# EAGLE schematic LARIX_V5.1 (EAGLE 6.5.0)

## Sheet 1 of 3
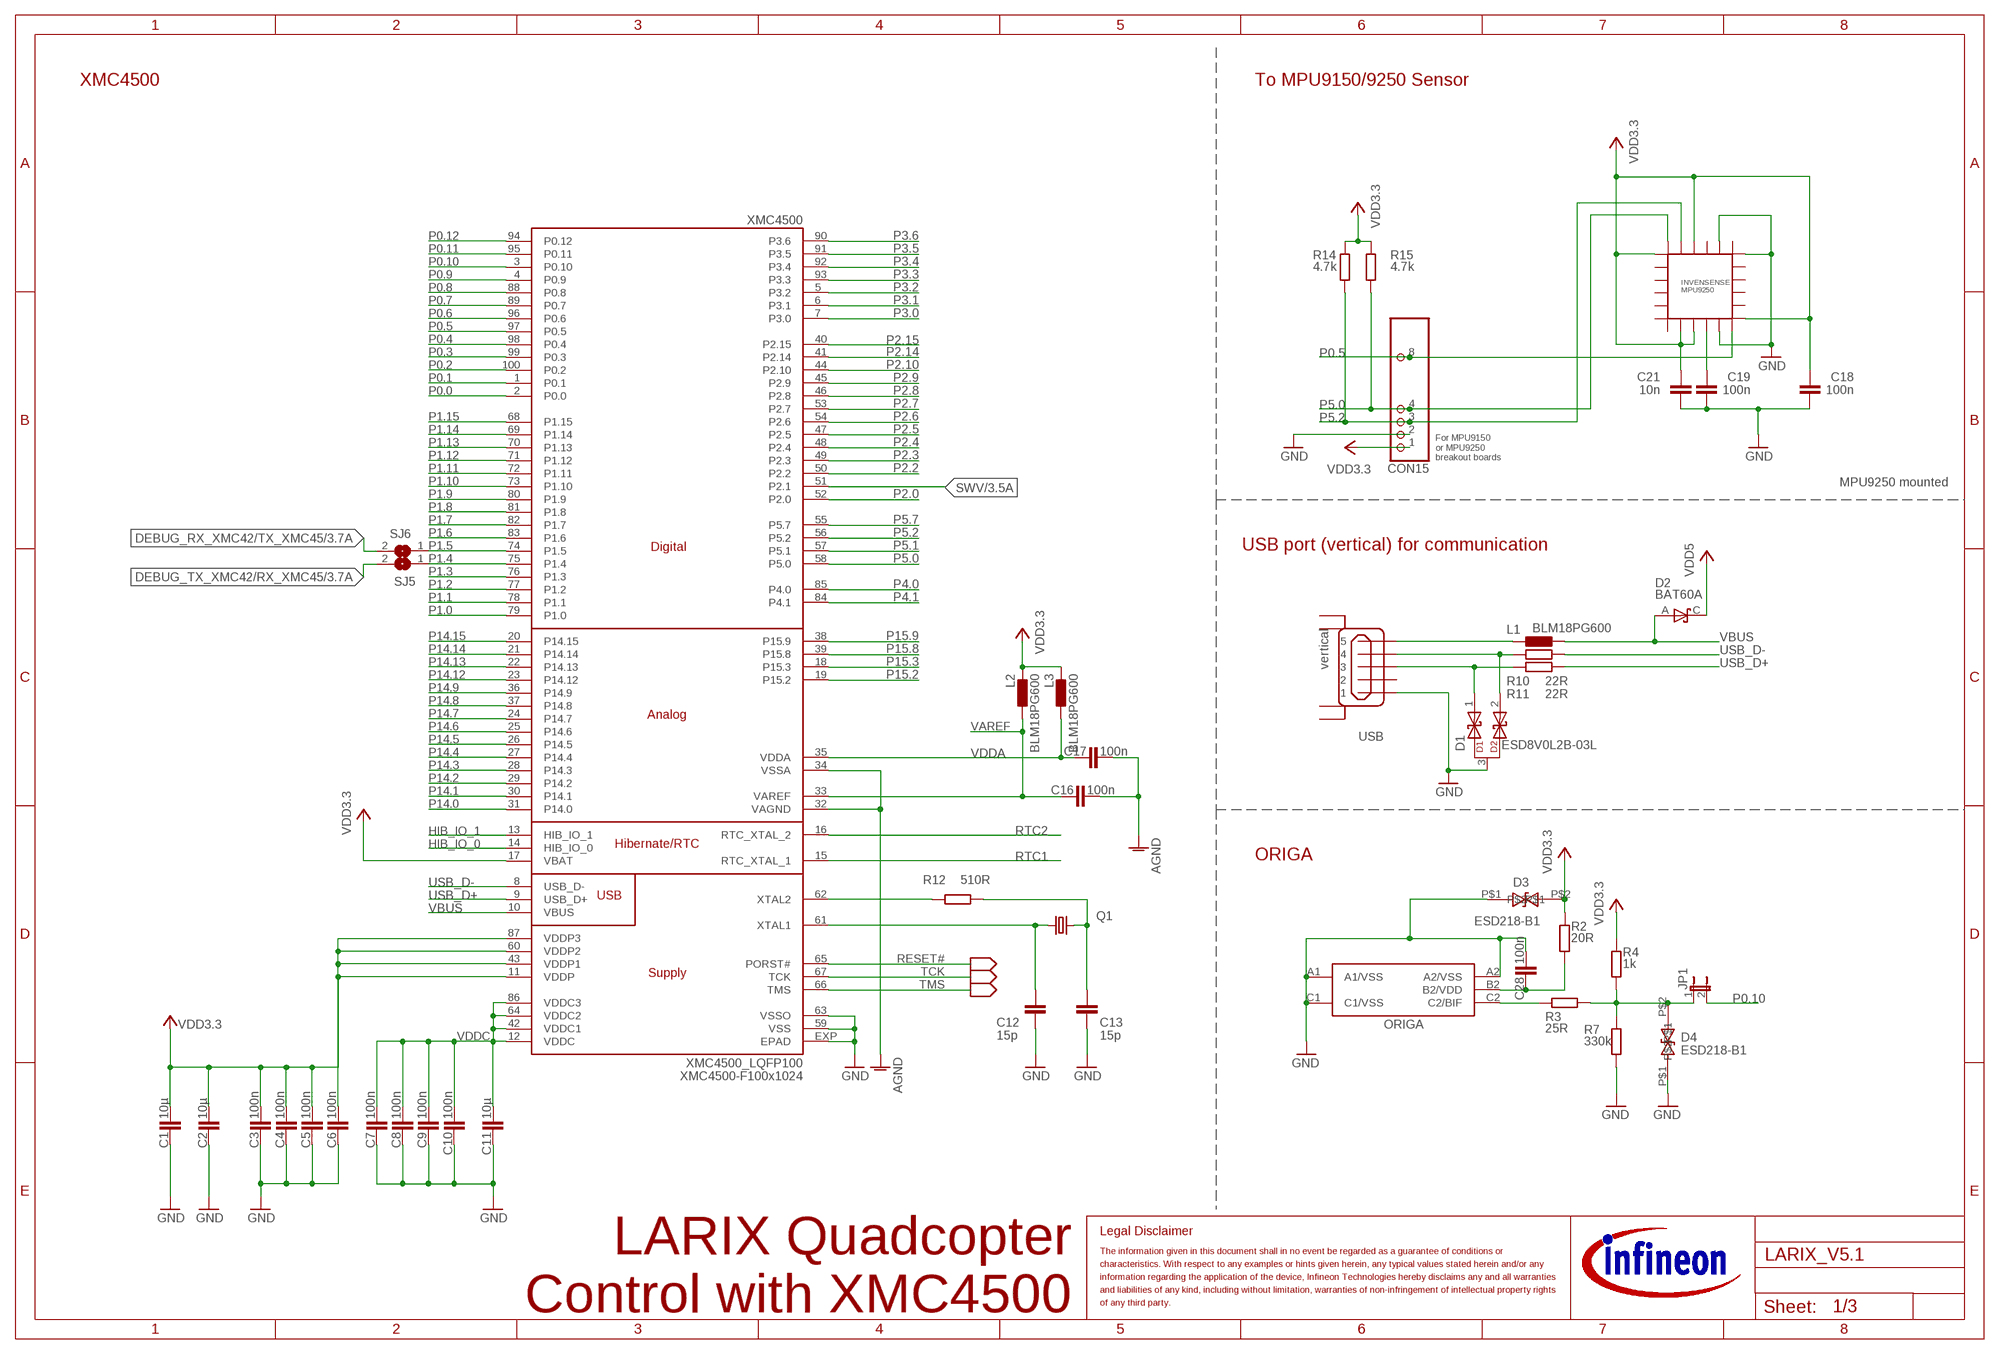
[diagram p0: schematic, sheet 1]

### Parts
C1  10µ  C-EUC0805K  [C0805K]
C2  10µ  C-EUC0805K  [C0805K]
C3  100n  C-EUC0603  [C0603]
C4  100n  C-EUC0603  [C0603]
C5  100n  C-EUC0603  [C0603]
C6  100n  C-EUC0603  [C0603]
C7  100n  C-EUC0603  [C0603]
C8  100n  C-EUC0603  [C0603]
C9  100n  C-EUC0603  [C0603]
C10  100n  C-EUC0603  [C0603]
C11  10µ  C-EUC0805K  [C0805K]
C12  15p  C-EUC0603  [C0603]
C13  15p  C-EUC0603  [C0603]
C16  100n  C-EUC0603  [C0603]
C17  100n  C-EUC0603  [C0603]
C18  100n  C-EUC0603  [C0603]
C19  100n  C-EUC0603  [C0603]
C21  10n  C-EUC0603  [C0603]
C28  100n  C-EUC0603  [C0603]
CON15  PINHD-1X10  [1X10]
D1  ESD8V0L2B-03L  [TSLP-3-1]
D2  BAT60A  BAT60  [SOD323-R]
D3  ESD218-B1-02EL  [TSLP-2-20]
D4  ESD218-B1-02EL  [TSLP-2-20]
JP1  JP1E  [JP1]
L1  BLM18PG600  L_EU_L0603  [L1608]
L2  BLM18PG600  L_EU_L0603  [L1608]
L3  BLM18PG600  L_EU_L0603  [L1608]
MPU9250  MPU9250  INVENSENSE9250EHERBY  [QFN3X3-24+]
ORIGA  ORIGA2L  [WLB-5]
Q1  12MHZ/S/3.2X2.5  NX3225_2  [32X25_4PAD]
R2  20R  R-EU_R0603  [R0603]
R3  25R  R-EU_R0603  [R0603]
R4  1k  R-EU_R0603  [R0603]
R7  330k  R-EU_R0603  [R0603]
R10  22R  R-EU_R0603  [R0603]
R11  22R  R-EU_R0603  [R0603]
R12  510R  R-EU_R0603  [R0603]
R14  4.7k  R-EU_R0603  [R0603]
R15  4.7k  R-EU_R0603  [R0603]
SJ5  SJ  [SJ]
SJ6  SJ  [SJ]
USB  vertical  MICRO_USB_VERTICAL  [USBVERTICAL]
XMC4500  XMC4500_LQFP100  XMC4400_LQFP100  [P/PG-LQFP-100-11]

### Nets
AGND: C16.2 C17.2 XMC4500.32(VAGND) XMC4500.34(VSSA)
DEBUG_RX_XMC42/TX_XMC45: SJ6.2 ; also sheet 3
DEBUG_TX_XMC42/RX_XMC45: SJ5.2 ; also sheet 3
GND: C1.2 C2.2 C3.2 C4.2 C5.2 C6.2 C7.2 C8.2 C9.2 C10.2 C11.2 C12.2 C13.2 C18.1 C19.1 C21.1 C28.1 CON15.2 D1.3 D3.P$1 D4.P$1 MPU9250.11 MPU9250.18 MPU9250.20 ORIGA.A1(A1/VSS) ORIGA.A2(A2/VSS) ORIGA.C1(C1/VSS) R7.2 USB.1 XMC4500.59(VSS) XMC4500.63(VSSO) XMC4500.EXP(EPAD) ; also sheet 2,3
HIB_IO_0: XMC4500.14(HIB_IO_0)
HIB_IO_1: XMC4500.13(HIB_IO_1)
N$2: C28.2 ORIGA.B2(B2/VDD) R2.2
N$6: R12.1 XMC4500.62(XTAL2)
N$7: C13.1 Q1.3 R12.2
N$8: C12.1 Q1.1 XMC4500.61(XTAL1)
N$9: D4.P$2 JP1.1 R3.2 R4.2 R7.1
N$11: L1.2 USB.5
N$12: ORIGA.C2(C2/BIF) R3.1
N$13: D1.2 R10.1 USB.4
N$20: C19.2 MPU9250.10
N$36: D1.1 R11.1 USB.3+
P0.0: XMC4500.2(P0.0) ; also sheet 2
P0.1: XMC4500.1(P0.1) ; also sheet 2
P0.2: XMC4500.100(P0.2) ; also sheet 2
P0.3: XMC4500.99(P0.3) ; also sheet 2
P0.4: XMC4500.98(P0.4) ; also sheet 2
P0.5: CON15.8 MPU9250.12 XMC4500.97(P0.5)
P0.6: XMC4500.96(P0.6)
P0.7: XMC4500.89(P0.7) ; also sheet 3
P0.8: XMC4500.88(P0.8)
P0.9: XMC4500.4(P0.9) ; also sheet 3
P0.10: JP1.2 XMC4500.3(P0.10)
P0.11: XMC4500.95(P0.11)
P0.12: XMC4500.94(P0.12)
P1.0: XMC4500.79(P1.0) ; also sheet 3
P1.1: XMC4500.78(P1.1) ; also sheet 3
P1.2: XMC4500.77(P1.2) ; also sheet 3
P1.3: XMC4500.76(P1.3) ; also sheet 3
P1.4: SJ5.1 XMC4500.75(P1.4)
P1.5: SJ6.1 XMC4500.74(P1.5) ; also sheet 2
P1.6: XMC4500.83(P1.6)
P1.7: XMC4500.82(P1.7)
P1.8: XMC4500.81(P1.8)
P1.9: XMC4500.80(P1.9)
P1.10: XMC4500.73(P1.10)
P1.11: XMC4500.72(P1.11)
P1.12: XMC4500.71(P1.12)
P1.13: XMC4500.70(P1.13)
P1.14: XMC4500.69(P1.14)
P1.15: XMC4500.68(P1.15) ; also sheet 2
P2.0: XMC4500.52(P2.0)
P2.2: XMC4500.50(P2.2) ; also sheet 2
P2.3: XMC4500.49(P2.3) ; also sheet 2
P2.4: XMC4500.48(P2.4) ; also sheet 2
P2.5: XMC4500.47(P2.5) ; also sheet 2
P2.6: XMC4500.54(P2.6)
P2.7: XMC4500.53(P2.7)
P2.8: XMC4500.46(P2.8)
P2.9: XMC4500.45(P2.9)
P2.10: XMC4500.44(P2.10)
P2.14: XMC4500.41(P2.14)
P2.15: XMC4500.40(P2.15)
P3.0: XMC4500.7(P3.0) ; also sheet 3
P3.1: XMC4500.6(P3.1) ; also sheet 3
P3.2: XMC4500.5(P3.2) ; also sheet 3
P3.3: XMC4500.93(P3.3)
P3.4: XMC4500.92(P3.4)
P3.5: XMC4500.91(P3.5) ; also sheet 2
P3.6: XMC4500.90(P3.6)
P4.0: XMC4500.85(P4.0) ; also sheet 2
P4.1: XMC4500.84(P4.1)
P5.0: CON15.4 MPU9250.24 R15.1 XMC4500.58(P5.0)
P5.1: XMC4500.57(P5.1) ; also sheet 2
P5.2: CON15.3 MPU9250.23 R14.1 XMC4500.56(P5.2)
P5.7: XMC4500.55(P5.7)
P14.0: XMC4500.31(P14.0)
P14.1: XMC4500.30(P14.1)
P14.2: XMC4500.29(P14.2)
P14.3: XMC4500.28(P14.3)
P14.4: XMC4500.27(P14.4)
P14.5: XMC4500.26(P14.5) ; also sheet 2
P14.6: XMC4500.25(P14.6)
P14.7: XMC4500.24(P14.7) ; also sheet 2
P14.8: XMC4500.37(P14.8) ; also sheet 2
P14.9: XMC4500.36(P14.9)
P14.12: XMC4500.23(P14.12)
P14.13: XMC4500.22(P14.13)
P14.14: XMC4500.21(P14.14)
P14.15: XMC4500.20(P14.15)
P15.2: XMC4500.19(P15.2)
P15.3: XMC4500.18(P15.3)
P15.8: XMC4500.39(P15.8)
P15.9: XMC4500.38(P15.9)
RESET#: XMC4500.65(PORST#) ; also sheet 3
RTC1: XMC4500.15(RTC_XTAL_1)
RTC2: XMC4500.16(RTC_XTAL_2)
SWV: XMC4500.51(P2.1) ; also sheet 3
TCK: XMC4500.67(TCK) ; also sheet 3
TMS: XMC4500.66(TMS) ; also sheet 3
USB_D+: R11.2 XMC4500.9(USB_D+)
USB_D-: R10.2 XMC4500.8(USB_D-)
VAREF: C16.1 L2.1 XMC4500.33(VAREF)
VBUS: D2.A L1.1 XMC4500.10(VBUS)
VDD3.3: C1.1 C2.1 C3.1 C4.1 C5.1 C6.1 C18.2 C21.2 CON15.1 D3.P$2 L2.2 L3.2 MPU9250.1 MPU9250.8 MPU9250.9 MPU9250.13 MPU9250.22 R2.1 R4.1 R14.2 R15.2 XMC4500.11(VDDP) XMC4500.17(VBAT) XMC4500.43(VDDP1) XMC4500.60(VDDP2) XMC4500.87(VDDP3) ; also sheet 2,3
VDD5: D2.C ; also sheet 2,3
VDDA: C17.1 L3.1 XMC4500.35(VDDA)
VDDC: C7.1 C8.1 C9.1 C10.1 C11.1 XMC4500.12(VDDC) XMC4500.42(VDDC1) XMC4500.64(VDDC2) XMC4500.86(VDDC3)
Unconnected: MPU9250.2 MPU9250.3 MPU9250.4 MPU9250.5 MPU9250.6 MPU9250.7 MPU9250.14 MPU9250.15 MPU9250.16 MPU9250.17 MPU9250.19 MPU9250.21 USB.2 USB.P$1(PGH1) USB.P$2(PGH2) USB.P$3(PGH3) USB.P$4(PGH4)

### Notes on the sheet
- XMC4500 | To MPU9150/9250 Sensor
- For MPU9150
  or MPU9250 
  breakout boards
- MPU9250 mounted
- USB port (vertical) for communication
- ORIGA
- D3
- ESD218-B1
- ORIGA
- D4
- ESD218-B1
- XMC4500-F100x1024
- LARIX Quadcopter 
  Control with XMC4500

## Sheet 2 of 3
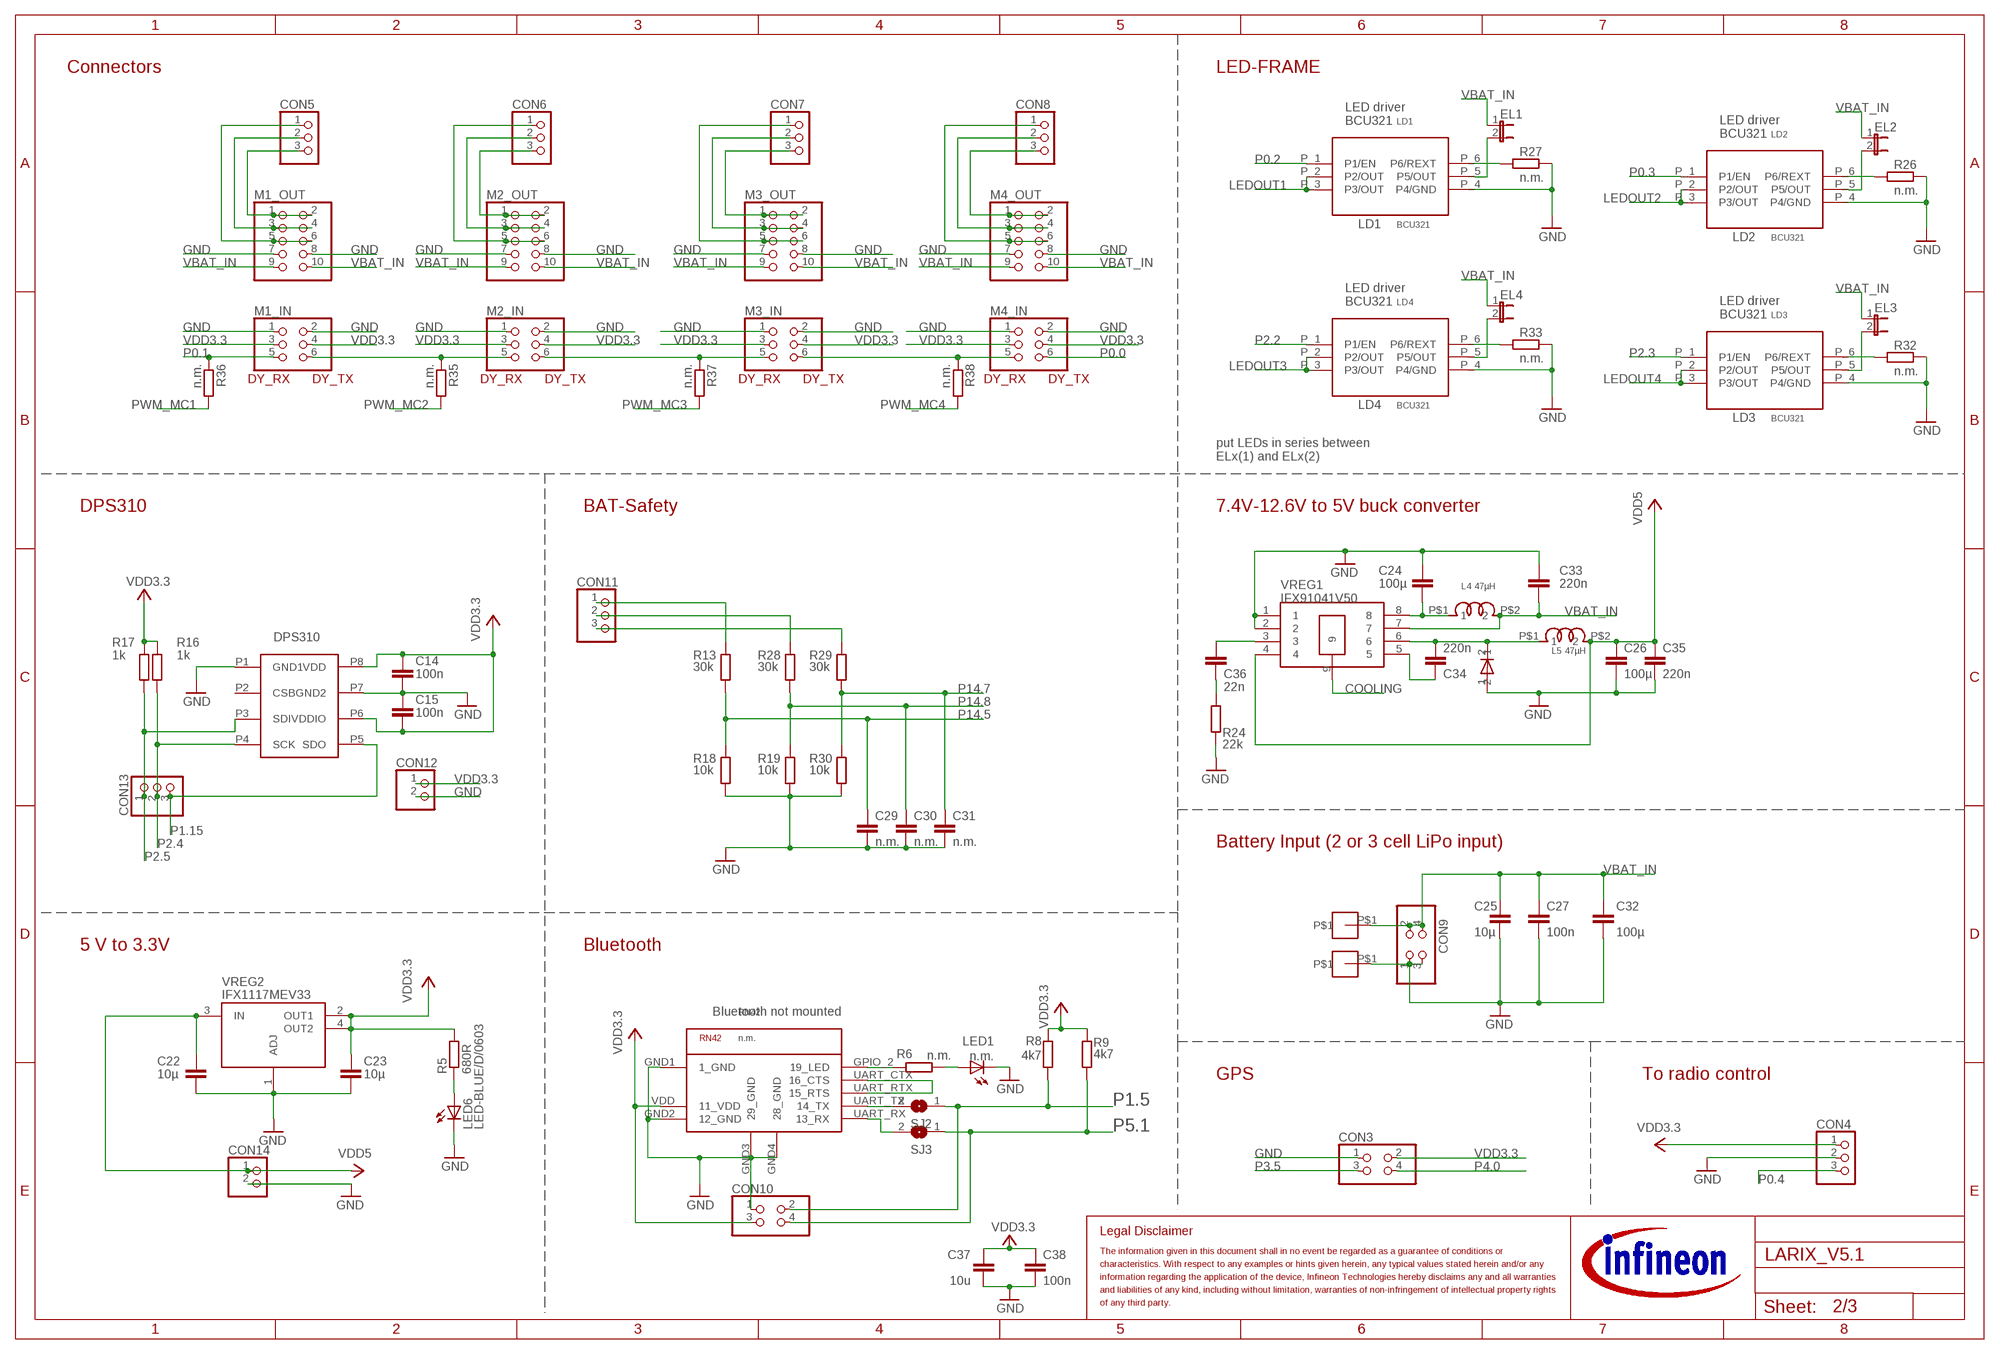
[diagram p1: schematic, sheet 2]

### Parts
C14  100n  C-EUC0603  [C0603]
C15  100n  C-EUC0603  [C0603]
C22  10µ  C-EUC0805K  [C0805K]
C23  10µ  C-EUC0805K  [C0805K]
C24  100µ  C-EUC1210  [C1210]
C25  10µ  C-EUC0805K  [C0805K]
C26  100µ  C-EUC1210  [C1210]
C27  100n  C-EUC0603  [C0603]
C29  n.m.  C-EUC0603  [C0603]
C30  n.m.  C-EUC0603  [C0603]
C31  n.m.  C-EUC0603  [C0603]
C32  100µ  C-EUC1210  [C1210]
C33  220n  C-EUC0603  [C0603]
C34  220n  C-EUC0603  [C0603]
C35  220n  C-EUC0603  [C0603]
C36  22n  C-EUC0603  [C0603]
C37  10u  C-EUC0805K  [C0805K]
C38  100n  C-EUC0603  [C0603]
CON3  PINHD-2X2  [2X02]
CON4  PINHD-1X3  [1X03]
CON5  PINHD-1X3  [1X03]
CON6  PINHD-1X3  [1X03]
CON7  PINHD-1X3  [1X03]
CON8  PINHD-1X3  [1X03]
CON9  PINHD-2X2  [2X02]
CON10  PINHD-2X2  [2X02]
CON11  PINHD-1X3  [1X03]
CON12  PINHD-1X2  [1X02]
CON13  PINHD-1X3  [1X03]
CON14  PINHD-1X2  [1X02]
D6  BAS21-03W  INF-SOD323_V_1  [INF-SOD323_V_1PRIMARY]
DPS310  Infineon  DPS310DRUCKSENSOR  [LGA8R125P0X4_500X300X120]
EL1  JP1E  [JP1]
EL2  JP1E  [JP1]
EL3  JP1E  [JP1]
EL4  JP1E  [JP1]
L4  47µH  WUERTH47UHIND  [WE-TPC]
L5  47µH  WUERTH47UHIND  [WE-TPC]
LD1  BCU321  BCU320  [SC74]
LD2  BCU321  BCU320  [SC74]
LD3  BCU321  BCU320  [SC74]
LD4  BCU321  BCU320  [SC74]
LED1  n.m.  LEDCHIPLED_0603  [CHIPLED_0603]
LED6  LED-BLUE/D/0603  LEDCHIPLED_0603  [CHIPLED_0603]
M1_IN  PINHD-2X3  [2X03]
M1_OUT  PINHD-2X5  [2X05]
M2_IN  PINHD-2X3  [2X03]
M2_OUT  PINHD-2X5  [2X05]
M3_IN  PINHD-2X3  [2X03]
M3_OUT  PINHD-2X5  [2X05]
M4_IN  PINHD-2X3  [2X03]
M4_OUT  PINHD-2X5  [2X05]
PAD1  PAD-BATTERY  [BATT-SOLDER]
PAD2  PAD-BATTERY  [BATT-SOLDER]
R5  680R  R-EU_R0603  [R0603]
R6  n.m.  R-EU_R0603  [R0603]
R8  4k7  R-EU_R0603  [R0603]
R9  4k7  R-EU_R0603  [R0603]
R13  30k  R-EU_R0603  [R0603]
R16  1k  R-EU_R0603  [R0603]
R17  1k  R-EU_R0603  [R0603]
R18  10k  R-EU_R0603  [R0603]
R19  10k  R-EU_R0603  [R0603]
R24  22k  R-EU_R0603  [R0603]
R26  n.m.  R-EU_R0603  [R0603]
R27  n.m.  R-EU_R0603  [R0603]
R28  30k  R-EU_R0603  [R0603]
R29  30k  R-EU_R0603  [R0603]
R30  10k  R-EU_R0603  [R0603]
R32  n.m.  R-EU_R0603  [R0603]
R33  n.m.  R-EU_R0603  [R0603]
R35  n.m.  R-EU_R0603  [R0603]
R36  n.m.  R-EU_R0603  [R0603]
R37  n.m.  R-EU_R0603  [R0603]
R38  n.m.  R-EU_R0603  [R0603]
RN42  n.m.  BLUETOOTHRN42+SHIELD  [RN42+SHIELD]
SJ2  SJ  [SJ]
SJ3  SJ  [SJ]
VREG1  IFX91041V50  INF-PG-DSO-8-27_N_1  [INF-PG-DSO-8-27_N_1PRIMARY]
VREG2  IFX1117MEV33  IFX1117  [SOT223]

### Nets
COOLING: VREG1.9
GND: C14.2 C15.1 C22.2 C23.2 C24.1 C25.2 C26.2 C27.2 C29.2 C30.2 C31.2 C32.2 C33.1 C35.2 C37.2 C38.2 CON3.1 CON4.2 CON9.1 CON9.3 CON10.1 CON12.2 CON14.2 D6.1 DPS310.P1(GND1) DPS310.P7(GND2) LD1.P_4(P4/GND) LD2.P_4(P4/GND) LD3.P_4(P4/GND) LD4.P_4(P4/GND) LED1.C LED6.C M1_IN.1 M1_IN.2 M1_OUT.7 M1_OUT.8 M2_IN.1 M2_IN.2 M2_OUT.7 M2_OUT.8 M3_IN.1 M3_IN.2 M3_OUT.7 M3_OUT.8 M4_IN.1 M4_IN.2 M4_OUT.7 M4_OUT.8 PAD2.P$1 R18.2 R19.2 R24.2 R26.2 R27.2 R30.2 R32.2 R33.2 RN42.GND1(1_GND) RN42.GND2(12_GND) RN42.GND3(29_GND) RN42.GND4(28_GND) VREG1.1 VREG1.2 VREG2.1(ADJ) ; also sheet 1,3
LEDOUT1: EL1.2 LD1.P_2(P2/OUT) LD1.P_3(P3/OUT) LD1.P_5(P5/OUT)
LEDOUT2: EL2.2 LD2.P_2(P2/OUT) LD2.P_3(P3/OUT) LD2.P_5(P5/OUT)
LEDOUT3: EL4.2 LD4.P_2(P2/OUT) LD4.P_3(P3/OUT) LD4.P_5(P5/OUT)
LEDOUT4: EL3.2 LD3.P_2(P2/OUT) LD3.P_3(P3/OUT) LD3.P_5(P5/OUT)
N$4: C36.1 VREG1.3
N$14: CON5.1 M1_OUT.5 M1_OUT.6
N$15: LED6.A R5.1
N$16: M2_IN.6 M3_IN.5 R37.1
N$17: C36.2 R24.1
N$18: LED1.A R6.1
N$21: CON5.2 M1_OUT.3 M1_OUT.4
N$25: CON5.3 M1_OUT.1 M1_OUT.2
N$26: R6.2 RN42.GPIO_2(19_LED)
N$27: RN42.UART_CTX(16_CTS) RN42.UART_RTX(15_RTS)
N$28: C24.2 L4.P$1 VREG1.8
N$30: C34.1 D6.2 L5.P$1 VREG1.6
N$31: LD2.P_6(P6/REXT) R26.1
N$33: LD1.P_6(P6/REXT) R27.1
N$35: CON6.1 M2_OUT.5 M2_OUT.6
N$37: CON11.1 R13.1
N$38: CON6.3 M2_OUT.1 M2_OUT.2
N$40: CON6.2 M2_OUT.3 M2_OUT.4
N$41: CON11.2 R28.1
N$42: CON8.1 M4_OUT.5 M4_OUT.6
N$43: CON11.3 R29.1
N$45: CON8.3 M4_OUT.1 M4_OUT.2
N$46: CON8.2 M4_OUT.3 M4_OUT.4
N$47: C34.2 VREG1.5
N$49: CON7.1 M3_OUT.5 M3_OUT.6
N$50: CON7.2 M3_OUT.3 M3_OUT.4
N$53: CON7.3 M3_OUT.1 M3_OUT.2
N$54: M3_IN.6 M4_IN.5 R38.1
N$55: M1_IN.6 M2_IN.5 R35.1
N$59: LD3.P_6(P6/REXT) R32.1
N$60: LD4.P_6(P6/REXT) R33.1
N$61: RN42.UART_TX(14_TX) SJ2.2
N$62: RN42.UART_RX(13_RX) SJ3.2
P0.0: M4_IN.6 ; also sheet 1
P0.1: M1_IN.5 R36.1 ; also sheet 1
P0.2: LD1.P_1(P1/EN) ; also sheet 1
P0.3: LD2.P_1(P1/EN) ; also sheet 1
P0.4: CON4.3 ; also sheet 1
P1.5: CON10.2 R8.2 SJ2.1 ; also sheet 1
P1.15: CON13.3 DPS310.P5(SDO) ; also sheet 1
P2.2: LD4.P_1(P1/EN) ; also sheet 1
P2.3: LD3.P_1(P1/EN) ; also sheet 1
P2.4: CON13.2 DPS310.P4(SCK) R16.2 ; also sheet 1
P2.5: CON13.1 DPS310.P3(SDI) R17.2 ; also sheet 1
P3.5: CON3.3 ; also sheet 1
P4.0: CON3.4 ; also sheet 1
P5.1: CON10.4 R9.2 SJ3.1 ; also sheet 1
P14.5: C29.1 R13.2 R18.1 ; also sheet 1
P14.7: C31.1 R29.2 R30.1 ; also sheet 1
P14.8: C30.1 R19.1 R28.2 ; also sheet 1
PWM_MC1: R36.2 ; also sheet 3
PWM_MC2: R35.2 ; also sheet 3
PWM_MC3: R37.2 ; also sheet 3
PWM_MC4: R38.2 ; also sheet 3
VBAT_IN: C25.1 C27.1 C32.1 C33.2 CON9.2 CON9.4 EL1.1 EL2.1 EL3.1 EL4.1 L4.P$2 M1_OUT.9 M1_OUT.10 M2_OUT.9 M2_OUT.10 M3_OUT.9 M3_OUT.10 M4_OUT.9 M4_OUT.10 PAD1.P$1 VREG1.7
VDD3.3: C14.1 C15.2 C23.1 C37.1 C38.1 CON3.2 CON4.1 CON10.3 CON12.1 DPS310.P6(VDDIO) DPS310.P8(VDD) M1_IN.3 M1_IN.4 M2_IN.3 M2_IN.4 M3_IN.3 M3_IN.4 M4_IN.3 M4_IN.4 R5.2 R8.1 R9.1 R16.1 R17.1 RN42.VDD(11_VDD) VREG2.2(OUT1) VREG2.4(OUT2) ; also sheet 1,3
VDD5: C22.1 C26.1 C35.1 CON14.1 L5.P$2 VREG1.4 VREG2.3(IN) ; also sheet 1,3
Unconnected: DPS310.P2(CSB)

### Notes on the sheet
- Connectors | LED-FRAME
- LED driver 
  BCU321
- LED driver 
  BCU321
- LD1
- LD2
- LED driver 
  BCU321
- LED driver 
  BCU321
- DY_RX | DY_TX | DY_RX | DY_TX | DY_RX | DY_TX | DY_RX | DY_TX
- LD4
- LD3
- put LEDs in series between
  ELx(1) and ELx(2)
- DPS310 | BAT-Safety | 7.4V-12.6V to 5V buck converter
- VREG1
  IFX91041V50
- DPS310
- Battery Input (2 or 3 cell LiPo input)
- 5 V to 3.3V | Bluetooth
- Bluetooth not mounted
- GPS | To radio control

## Sheet 3 of 3
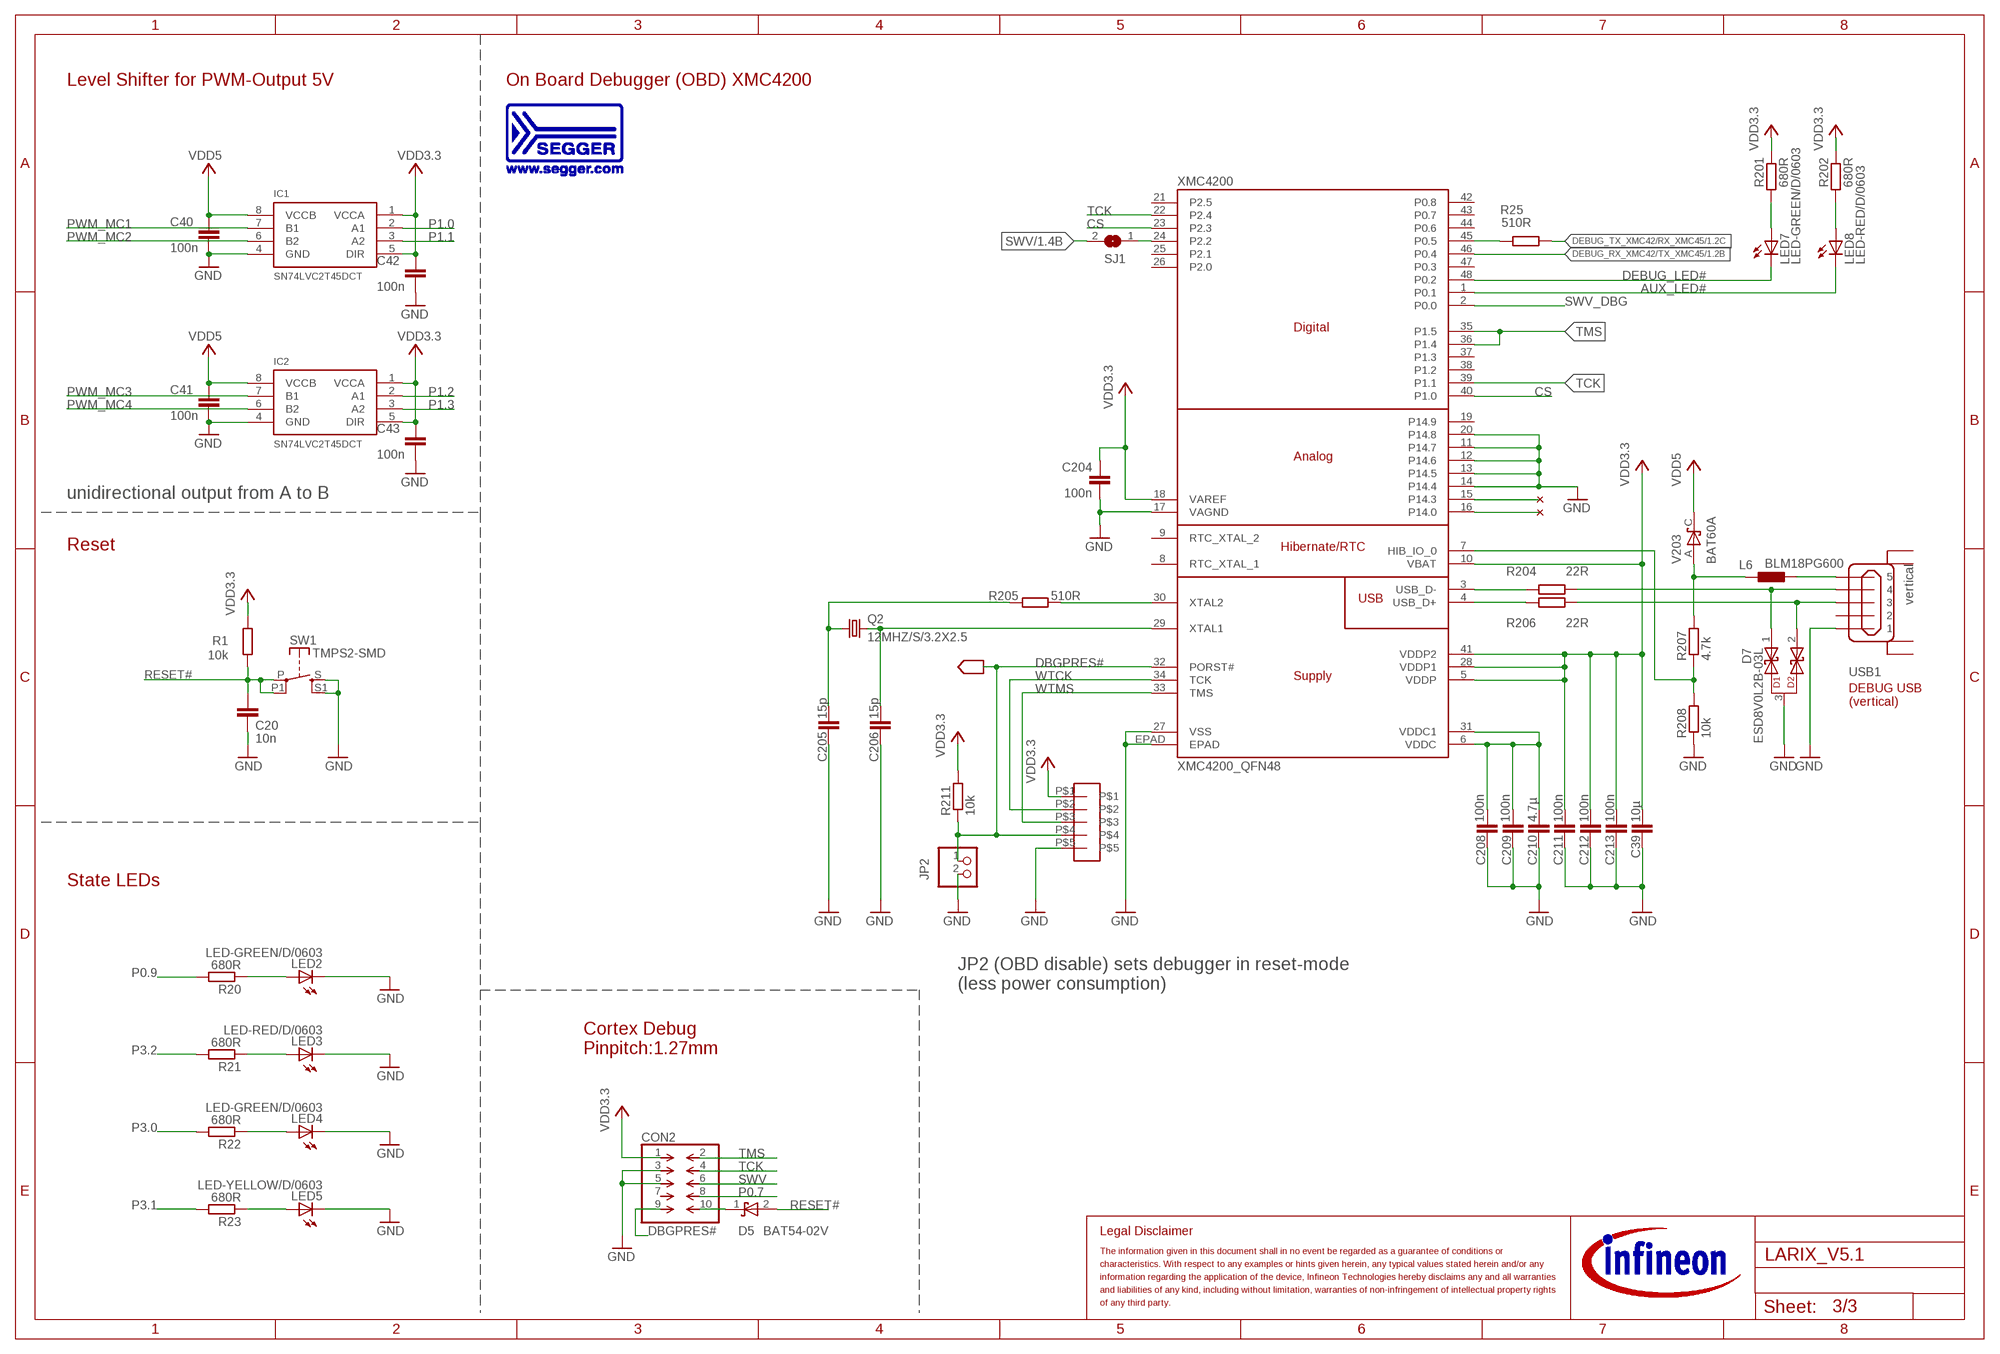
[diagram p2: schematic, sheet 3]

### Parts
C20  10n  C-EUC0603  [C0603]
C39  10µ  C-EUC0805K  [C0805K]
C40  100n  C-EUC0603  [C0603]
C41  100n  C-EUC0603  [C0603]
C42  100n  C-EUC0603  [C0603]
C43  100n  C-EUC0603  [C0603]
C204  100n  C-EUC0402  [C0402]
C205  15p  C-EUC0402  [C0402]
C206  15p  C-EUC0402  [C0402]
C208  100n  C-EUC0402  [C0402]
C209  100n  C-EUC0402  [C0402]
C210  4.7µ  C-EUC0805K  [C0805K]
C211  100n  C-EUC0402  [C0402]
C212  100n  C-EUC0402  [C0402]
C213  100n  C-EUC0402  [C0402]
CON2  FTSH-105-01-F-D-K  [FTSH-105-01-F-D-K]
D5  BAT54-02V  [SC79]
D7  ESD8V0L2B-03L  [TSLP-3-1]
IC1  SN74LVC2T45DCT  [DCT_R-PDSO-G8]
IC2  SN74LVC2T45DCT  [DCT_R-PDSO-G8]
JP2  PINHD-1X2  [1X02]
L6  BLM18PG600  L_EU_L0603  [L1608]
LED2  LED-GREEN/D/0603  LEDCHIPLED_0603  [CHIPLED_0603]
LED3  LED-RED/D/0603  LEDCHIPLED_0603  [CHIPLED_0603]
LED4  LED-GREEN/D/0603  LEDCHIPLED_0603  [CHIPLED_0603]
LED5  LED-YELLOW/D/0603  LEDCHIPLED_0603  [CHIPLED_0603]
LED7  LED-GREEN/D/0603  LEDCHIPLED_0603  [CHIPLED_0603]
LED8  LED-RED/D/0603  LEDCHIPLED_0603  [CHIPLED_0603]
Q2  12MHZ/S/3.2X2.5  NX3225_2  [32X25_4PAD]
R1  10k  R-EU_R0603  [R0603]
R20  680R  R-EU_R0603  [R0603]
R21  680R  R-EU_R0603  [R0603]
R22  680R  R-EU_R0603  [R0603]
R23  680R  R-EU_R0603  [R0603]
R25  510R  R-EU_R0402  [R0402]
R201  680R  R-EU_R0603  [R0603]
R202  680R  R-EU_R0603  [R0603]
R204  22R  R-EU_R0402  [R0402]
R205  510R  R-EU_R0603  [R0603]
R206  22R  R-EU_R0402  [R0402]
R207  4.7k  R-EU_R0402  [R0402]
R208  10k  R-EU_R0402  [R0402]
R211  10k  R-EU_R0402  [R0402]
SJ1  SJ  [SJ]
SW1  TMPS2-SMD  FSM2JSMA  [FSM2JSMA]
U$9  127MARKED  [PINHEAD_127]
U$11  SEGGER.L_100  [LOGO_100]
USB1  vertical  MICRO_USB_VERTICAL  [USBVERTICAL]
V203  BAT60A  BAT60  [SOD323-R]
XMC4200  XMC4200_QFN48  [QFN-48-7X7]

### Nets
AUX_LED#: LED8.C XMC4200.1(P0.1)
CS: XMC4200.23(P2.3) XMC4200.40(P1.0)
DBGPRES#: CON2.9 JP2.1 R211.1 U$9.P$4 XMC4200.32(PORST#)
DEBUG_LED#: LED7.C XMC4200.48(P0.2)
DEBUG_RX_XMC42/TX_XMC45: XMC4200.46(P0.4) ; also sheet 1
DEBUG_TX_XMC42/RX_XMC45: R25.2 ; also sheet 1
GND: C20.2 C39.2 C40.2 C41.2 C42.2 C43.2 C204.2 C205.2 C206.2 C208.2 C209.2 C210.2 C211.2 C212.2 C213.2 CON2.3 CON2.5 D7.3 IC1.4(GND) IC2.4(GND) JP2.2 LED2.C LED3.C LED4.C LED5.C R208.1 SW1.S SW1.S1(S) U$9.P$5 USB1.1 XMC4200.11(P14.7) XMC4200.12(P14.6) XMC4200.13(P14.5) XMC4200.14(P14.4) XMC4200.17(VAGND) XMC4200.20(P14.8) XMC4200.27(VSS) XMC4200.EPAD ; also sheet 1,2
N$1: LED2.A R20.1
N$3: LED3.A R21.1
N$10: D7.1 R204.2 USB1.4
N$19: CON2.10 D5.1(C)
N$22: LED4.A R22.1
N$24: LED5.A R23.1
N$29: D7.2 R206.2 USB1.3+
N$32: C205.1 Q2.1 R205.2
N$34: R205.1 XMC4200.30(XTAL2)
N$39: L6.2 R207.2 V203.A
N$44: C206.1 Q2.3 XMC4200.29(XTAL1)
N$48: LED7.A R201.2
N$51: R25.1 XMC4200.45(P0.5)
N$52: R207.1 R208.2 XMC4200.7(HIB_IO_0)
N$56: LED8.A R202.2
N$57: XMC4200.16(P14.0)
N$58: XMC4200.15(P14.3)
P0.7: CON2.8 ; also sheet 1
P0.9: R20.2 ; also sheet 1
P1.0: IC1.2(A1) ; also sheet 1
P1.1: IC1.3(A2) ; also sheet 1
P1.2: IC2.2(A1) ; also sheet 1
P1.3: IC2.3(A2) ; also sheet 1
P3.0: R22.2 ; also sheet 1
P3.1: R23.2 ; also sheet 1
P3.2: R21.2 ; also sheet 1
PWM_MC1: IC1.7(B1) ; also sheet 2
PWM_MC2: IC1.6(B2) ; also sheet 2
PWM_MC3: IC2.7(B1) ; also sheet 2
PWM_MC4: IC2.6(B2) ; also sheet 2
RESET#: C20.1 D5.2(A) R1.1 SW1.P SW1.P1(P) ; also sheet 1
SWV: CON2.6 SJ1.2 ; also sheet 1
SWV_DBG: SJ1.1 XMC4200.2(P0.0) XMC4200.24(P2.2)
TCK: CON2.4 XMC4200.22(P2.4) XMC4200.39(P1.1) ; also sheet 1
TMS: CON2.2 XMC4200.35(P1.5) XMC4200.36(P1.4) ; also sheet 1
USBVCC: L6.1 USB1.5
VDD3.3: C39.1 C42.1 C43.1 C204.1 C211.1 C212.1 C213.1 CON2.1 IC1.1(VCCA) IC1.5(DIR) IC2.1(VCCA) IC2.5(DIR) R1.2 R201.1 R202.1 R211.2 U$9.P$1 XMC4200.5(VDDP) XMC4200.10(VBAT) XMC4200.18(VAREF) XMC4200.28(VDDP1) XMC4200.41(VDDP2) ; also sheet 1,2
VDD5: C40.1 C41.1 IC1.8(VCCB) IC2.8(VCCB) V203.C ; also sheet 1,2
WTCK: U$9.P$2 XMC4200.34(TCK)
WTMS: U$9.P$3 XMC4200.33(TMS)
WUSB_DM: R204.1 XMC4200.3(USB_D-)
WUSB_DP: R206.1 XMC4200.4(USB_D+)
WVDDC: C208.1 C209.1 C210.1 XMC4200.6(VDDC) XMC4200.31(VDDC1)
Unconnected: CON2.7 USB1.2 USB1.P$1(PGH1) USB1.P$2(PGH2) USB1.P$3(PGH3) USB1.P$4(PGH4) XMC4200.8(RTC_XTAL_1) XMC4200.9(RTC_XTAL_2) XMC4200.19(P14.9) XMC4200.21(P2.5) XMC4200.25(P2.1) XMC4200.26(P2.0) XMC4200.37(P1.3) XMC4200.38(P1.2) XMC4200.42(P0.8) XMC4200.43(P0.7) XMC4200.44(P0.6) XMC4200.47(P0.3)

### Notes on the sheet
- Level Shifter for PWM-Output 5V | On Board Debugger (OBD) XMC4200
- unidirectional output from A to B
- Reset
- DEBUG USB
  (vertical)
- State LEDs
- JP2 (OBD disable) sets debugger in reset-mode
  (less power consumption)
- Cortex Debug
  Pinpitch:1.27mm
- D5

## Library data of the parts
C1 C2 C11 C22 C23 C25 C37 C39 C210 = libHMI_OLED-V1:C-EU: CAPACITOR, European symbol
C3-C10 C12-C21 C24 C26-C36 C38 C40-C43 = libresistor:C-EU: CAPACITOR, European symbol
C204-C206 C208 C209 C211-C213 = libDsC:C-EUC0402
CON2 = Xtv127:FTSH-105-01-F-D-K
CON3 CON9 CON10 = pinhead:PINHD-2X2: PIN HEADER
CON4-CON8 CON11 CON13 = pinhead:PINHD-1X3: PIN HEADER
CON12 CON14 JP2 = pinhead:PINHD-1X2: PIN HEADER
CON15 = pinhead:PINHD-1X10: PIN HEADER
D1 D7 = libDsDiod:ESD8V0L2B-03L
D2 V203 = libDsDiod:BAT60
D3 D4 = libESD218-B1:ESD218-B1-02EL
D5 = libXMC4500_Relax-V1+USBvertical:BAT54-02V
D6 = libBAS21-03W_INF-SOD323V:INF-SOD323_V_1
DPS310 = libdrucksensorDPS310:DPS310DRUCKSENSOR
EL1-EL4 = libjumper:JP1E: JUMPER
IC1 IC2 = libLEVELSHIFTER_SN74LVCxT45:SN74LVC2T45
JP1 = jumper:JP1E: JUMPER
L1-L3 L6 = libPDFerr:L_EU_
L4 L5 = lib47µHWuerthChoke:WUERTH47UHIND
LD1-LD4 = libLEDtreiber BCR320U:BCU320
LED1-LED8 = libled:LED: LED OSRAM: - CHIPLED LG R971, LG N971, LY N971, LG Q971, LY Q971, LO R971, LY R971 LH N974, LH R974 LS Q976, LO Q976, LY Q976 LO Q996 - Hyper CHIPLED LW Q18S LB Q993, LB Q99A, LB R99A - SideLED LS A670, LO A670, LY A670, LG A670, LP A670 LB A673, LV A673, LT A673, LW A673 LH A674 LY A675 LS A676, LA A676, LO A676, LY A676, LW A676 LS A679, LY A679, LG A679 - Hyper Micro SIDELED® LS Y876, LA Y876, LO Y876, LY Y876 LT Y87S - SmartLED LW L88C, LW L88S LB L89C, LB L89S, LG L890 LS L89K, LO L89K, LY L89K LS L896, LA L896, LO L896, LY L896 - TOPLED LS T670, LO T670, LY T670, LG T670, LP T670 LSG T670, LSP T670, LSY T670, LOP T670, LYG T670 LG T671, LOG T671, LSG T671 LB T673, LV T673, LT T673, LW T673 LH T674 LS T676, LA T676, LO T676, LY T676, LB T676, LH T676, LSB T676, LW T676 LB T67C, LV T67C, LT T67C, LS T67K, LO T67K, LY T67K, LW E67C LS E67B, LA E67B, LO E67B, LY E67B, LB E67C, LV E67C, LT E67C LW T67C LS T679, LY T679, LG T679 LS T770, LO T770, LY T770, LG T770, LP T770 LB T773, LV T773, LT T773, LW T773 LH T774 LS E675, LA E675, LY E675, LS T675 LS T776, LA T776, LO T776, LY T776, LB T776 LHGB T686 LT T68C, LB T68C - Hyper Mini TOPLED® LB M676 - Mini TOPLED Santana® LG M470 LS M47K, LO M47K, LY M47K Source: http://www.osram.convergy.de/
M1_IN M2_IN M3_IN M4_IN = pinhead:PINHD-2X3: PIN HEADER
M1_OUT M2_OUT M3_OUT M4_OUT = pinhead:PINHD-2X5: PIN HEADER
MPU9250 = invensense9250:INVENSENSE9250: Herbys Model of a invensense 9250
ORIGA = libORIGA:ORIGA2L
PAD1 PAD2 = pad_battery:PAD-BATTERY
Q1 = libXMC4500_Relax-V1+USBvertical:NX3225_2
Q2 = libXMC4700_Relax-V1:NX3225_2
R1 R10 R11 R14 R15 R26 R27 R32 R33 R35 R36 R38 = libresistor:R-EU_: RESISTOR, European symbol
R2-R9 R12 R13 R16-R24 R28-R30 R37 R201 R202 R205 = libDsR:R-EU_R0603
R25 R204 R206-R208 R211 = libDsR:R-EU_R0402
RN42 = libbluetoothRN42:BLUETOOTHRN42+SHIELD
SJ1-SJ3 SJ5 SJ6 = jumper:SJ: SMD solder JUMPER
SW1 = libXMC4500_Relax-V1+USBvertical:FSM2JSMA
U$9 = pinhead_127_marked:127MARKED
U$11 = BOOTKIT1100SEGGER_logo:SEGGER
USB USB1 = libXMC4500_Relax-V1+USBvertical:MICRO_USB_VERTICAL
VREG1 = libInfineon-DCDC-91041 - DSO-8:INF-PG-DSO-8-27_N_1
VREG2 = libXMC4500_Relax-V1+USBvertical:IFX1117
XMC4200 = libXMC4000_v4.16:XMC4200_QFN48
XMC4500 = libXMC4500_Relax-V1+USBvertical:XMC4400_LQFP100